# Altium project PROC154E3_SCH.PrjPcb (part 37 of 60)

## Sheet 42. DISPLAY PORT.SchDoc: DISPLAY_PORT_INTERFACE
size 513 x 386 mm; Project: PROC154E2(001)_SK_AM69; Issue: 1.0; RevCode: E3; Page Create Date: March  8, 1995; Variant Name: Core Design; Schematic Page Number: 42; Page Number: 42; Page Size: C; Comment: MISTRAL_TITLEBLK_CSIZE_1; Page Count: 62; Schematic Page Count: 62; Name: PROC154E2 001 SK AM69; DsnPath: C:\Users\danie\Downloads\sprr466c\PROC154E3_RP\PROC154E3_SCH.DSN; SchematicName: SCHEMATIC1; PageName: 42. DISPLAY PORT; PageSize: C; TopSchematic: True
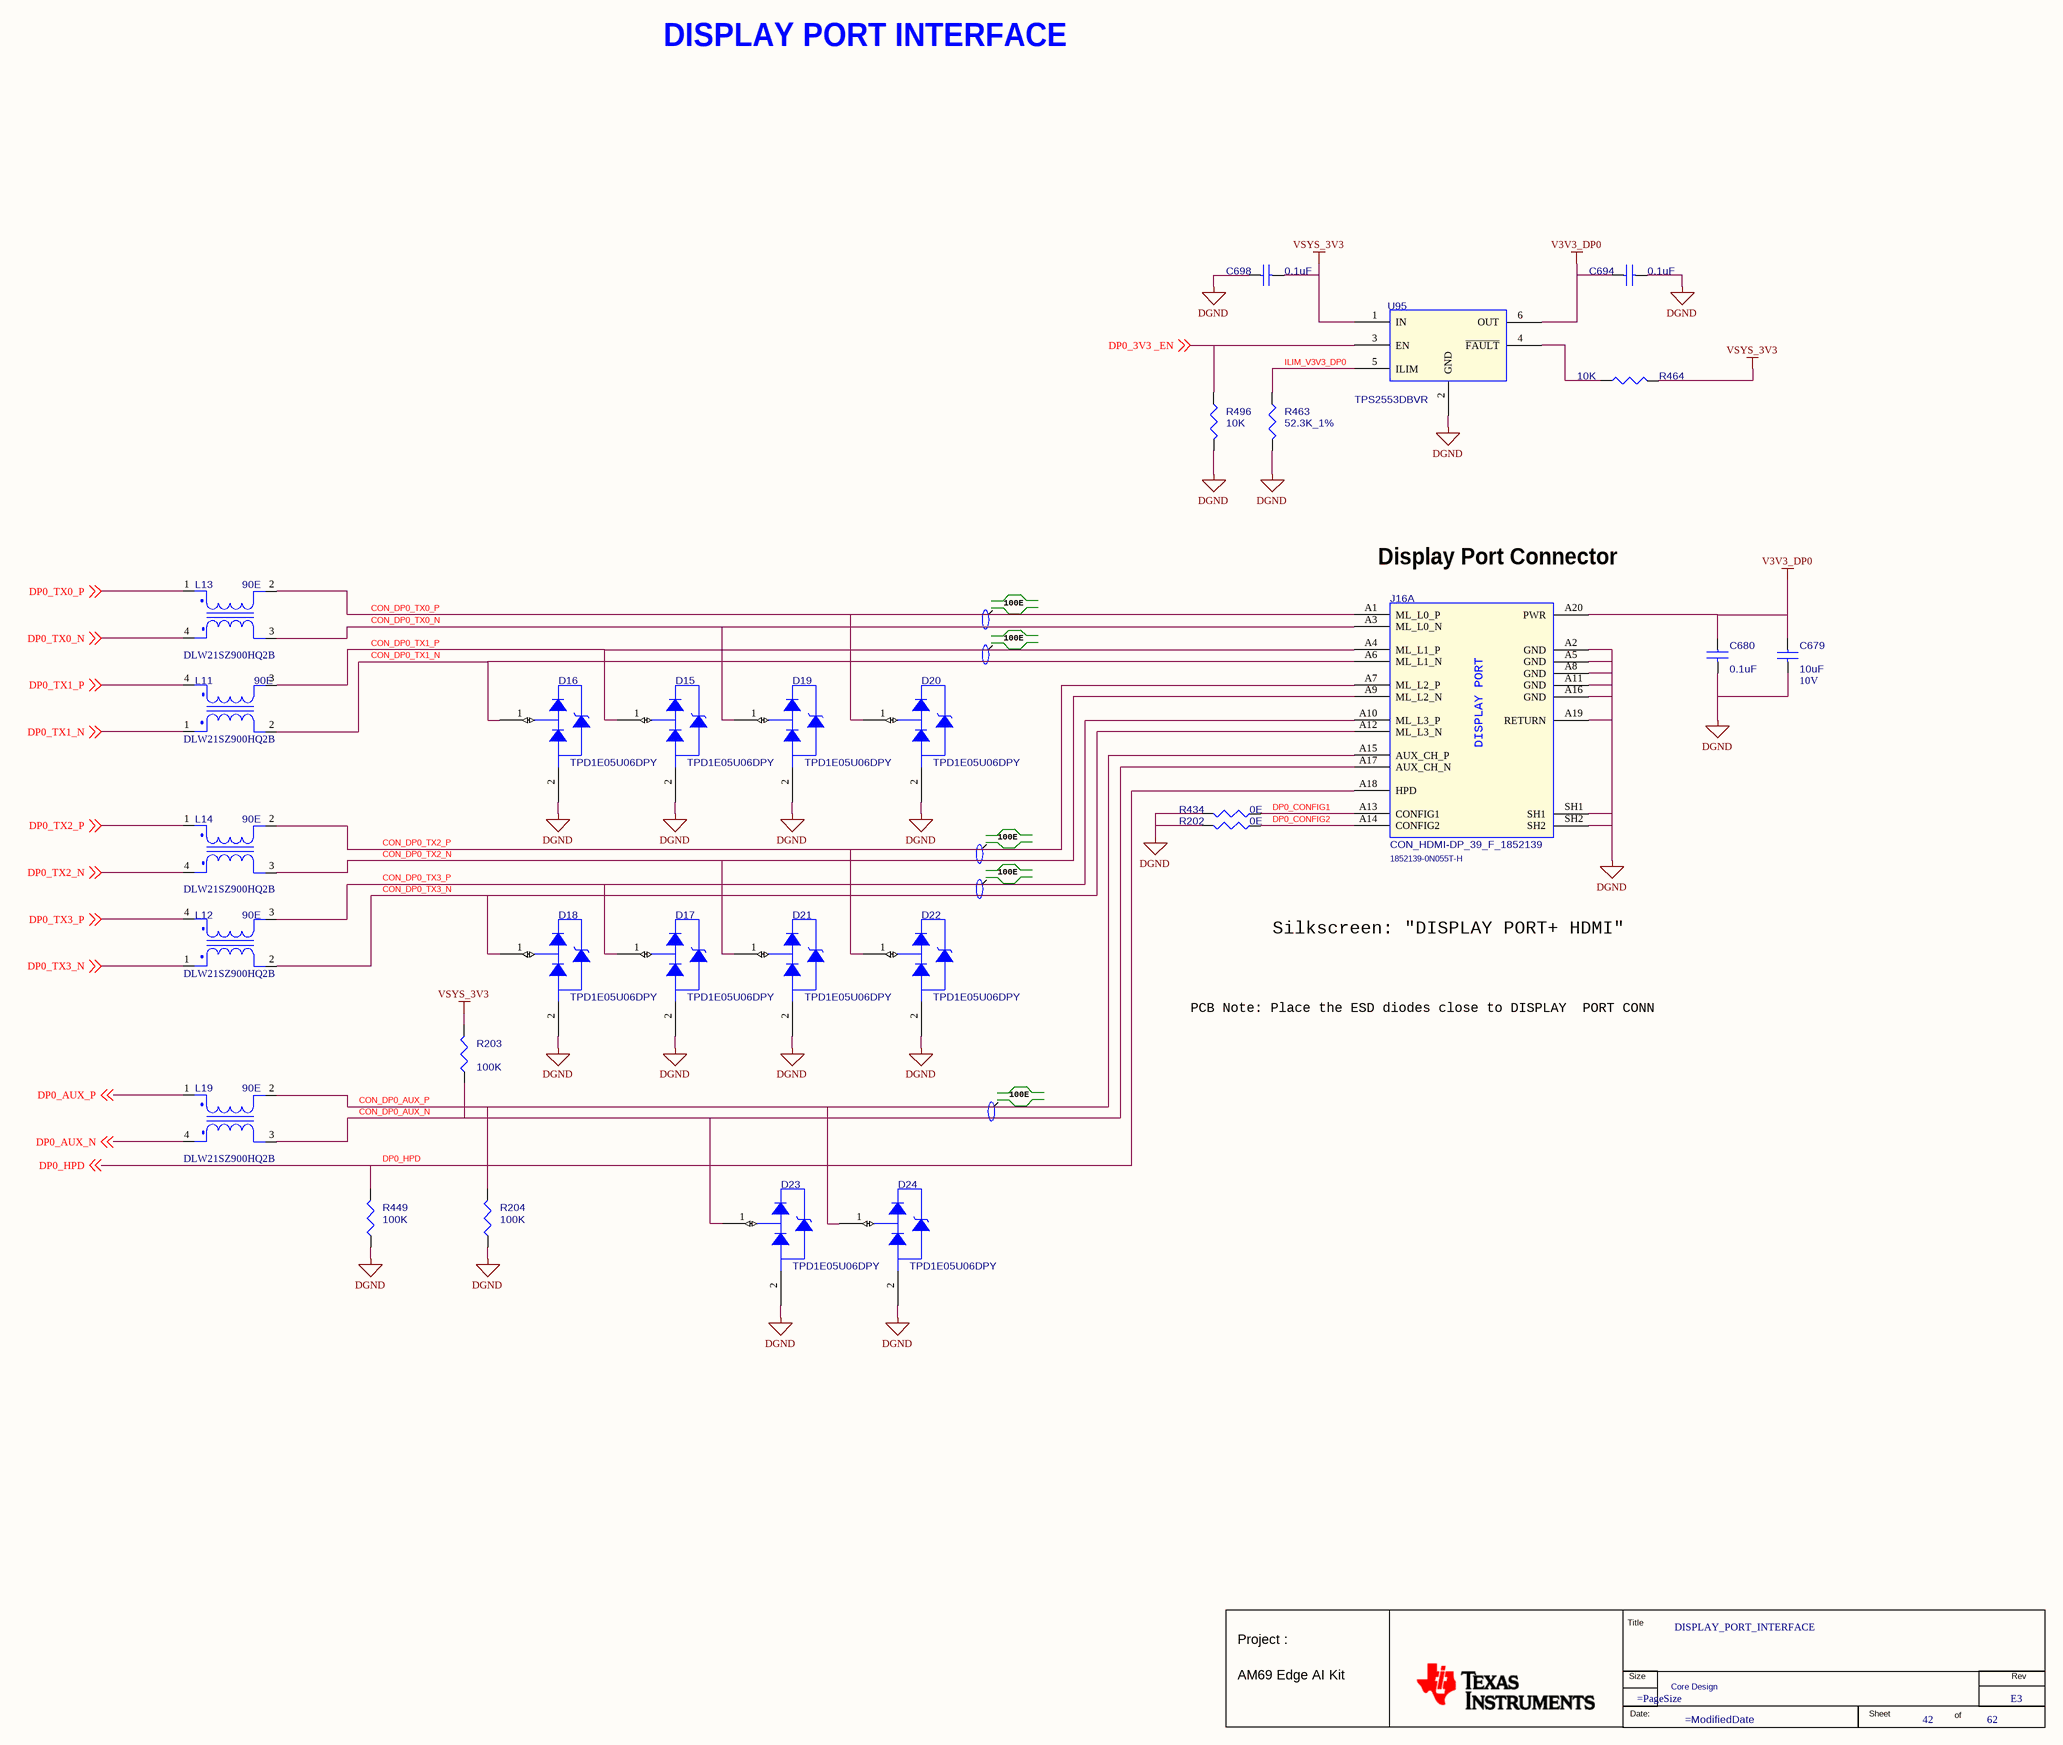
[diagram p69: 42. DISPLAY PORT.SchDoc]

### Parts
(Parts that share a designator on the sheet are numbered #1, #2 ... from top to bottom, then left to right.)
*#42  RevCode: E3  Title: DISPLAY_PORT_INTERFACE  Page Number: 42  Page Count: 62  Variant Name: Core Design  (hidden comment: MISTRAL_TITLEBLK_CSIZE_1)  (graphical)
C679  10uF  Voltage: 10V  [CAP0402_1]
C680  0.1uF  [CAP0201_0-5]
C694  0.1uF  [CAP0201_0-5]
C698  0.1uF  [CAP0201_0-5]
D15  TPD1E05U06DPY  [DIO_DFN0402_0-5]
D16  TPD1E05U06DPY  [DIO_DFN0402_0-5]
D17  TPD1E05U06DPY  [DIO_DFN0402_0-5]
D18  TPD1E05U06DPY  [DIO_DFN0402_0-5]
D19  TPD1E05U06DPY  [DIO_DFN0402_0-5]
D20  TPD1E05U06DPY  [DIO_DFN0402_0-5]
D21  TPD1E05U06DPY  [DIO_DFN0402_0-5]
D22  TPD1E05U06DPY  [DIO_DFN0402_0-5]
D23  TPD1E05U06DPY  [DIO_DFN0402_0-5]
D24  TPD1E05U06DPY  [DIO_DFN0402_0-5]
J16  CON_HDMI-DP_39_F_1852139  Mfr_part_number: 1852139-0N055T-H  [CON_HDMI-DP39_1852139-0N055_S_R_T_19-8]  (part A of 2)
L11  90E  Mfr_part_number: DLW21SZ900HQ2B  [IND4_DLW21H_90X60_SMD_1-4]
L12  90E  Mfr_part_number: DLW21SZ900HQ2B  [IND4_DLW21H_90X60_SMD_1-4]
L13  90E  Mfr_part_number: DLW21SZ900HQ2B  [IND4_DLW21H_90X60_SMD_1-4]
L14  90E  Mfr_part_number: DLW21SZ900HQ2B  [IND4_DLW21H_90X60_SMD_1-4]
L19  90E  Mfr_part_number: DLW21SZ900HQ2B  [IND4_DLW21H_90X60_SMD_1-4]
R202  0E  [RES0402_0-5]
R203  100K  [RES0402_0-5]
R204  100K  [RES0402_0-5]
R434  0E  [RES0402_0-5]
R449  100K  [RES0402_0-5]
R463  52.3K_1%  [RES0201_0-5]
R464  10K  [RES0201_0-5]
R496  10K  [RES0201_0-5]
U95  TPS2553DBVR  [SOT23-6_1-5]

### Nets
DGND: C679.2 C680.2 C694.2 C698.1 D15.2(GND) D16.2(GND) D17.2(GND) D18.2(GND) D19.2(GND) D20.2(GND) D21.2(GND) D22.2(GND) D23.2(GND) D24.2(GND) J16.A2(GND) J16.A5(GND) J16.A8(GND) J16.A11(GND) J16.A16(GND) J16.A19(RETURN) J16.SH1 J16.SH2 R202.2 R204.1 R434.2 R449.1 R463.2 R496.2 U95.2(GND)  [project net VDD_CPU_HCPS_GOSNS]
V3V3_DP0: C679.1 C680.1 C694.1 J16.A20(PWR) U95.6(OUT)
VSYS_3V3: C698.2 R203.2 R464.1 U95.1(IN)  [project net V_3V3]
CON_DP0_AUX_N: D23.1(I/O) J16.A17(AUX_CH_N) L19.3(OUT1) R203.1
CON_DP0_AUX_P: D24.1(I/O) J16.A15(AUX_CH_P) L19.2(IN2) R204.2
CON_DP0_TX0_N: D19.1(I/O) J16.A3(ML_L0_N) L13.3(OUT1)
CON_DP0_TX0_P: D20.1(I/O) J16.A1(ML_L0_P) L13.2(IN2)
CON_DP0_TX1_N: D16.1(I/O) J16.A6(ML_L1_N) L11.2(IN2)
CON_DP0_TX1_P: D15.1(I/O) J16.A4(ML_L1_P) L11.3(OUT1)
CON_DP0_TX2_N: D21.1(I/O) J16.A9(ML_L2_N) L14.3(OUT1)
CON_DP0_TX2_P: D22.1(I/O) J16.A7(ML_L2_P) L14.2(IN2)
CON_DP0_TX3_N: D18.1(I/O) J16.A12(ML_L3_N) L12.2(IN2)
CON_DP0_TX3_P: D17.1(I/O) J16.A10(ML_L3_P) L12.3(OUT1)
DP0_3V3 _EN: R496.1 U95.3(EN) ; off-sheet DP0_3V3 _EN
DP0_AUX_N: L19.4(OUT2) ; off-sheet DP0_AUX_N
DP0_AUX_P: L19.1(IN1) ; off-sheet DP0_AUX_P
DP0_CONFIG1: J16.A13(CONFIG1) R434.1
DP0_CONFIG2: J16.A14(CONFIG2) R202.1
DP0_HPD: J16.A18(HPD) R449.2 ; off-sheet DP0_HPD
DP0_TX0_N: L13.4(OUT2) ; off-sheet DP0_TX0_N
DP0_TX0_P: L13.1(IN1) ; off-sheet DP0_TX0_P
DP0_TX1_N: L11.1(IN1) ; off-sheet DP0_TX1_N
DP0_TX1_P: L11.4(OUT2) ; off-sheet DP0_TX1_P
DP0_TX2_N: L14.4(OUT2) ; off-sheet DP0_TX2_N
DP0_TX2_P: L14.1(IN1) ; off-sheet DP0_TX2_P
DP0_TX3_N: L12.1(IN1) ; off-sheet DP0_TX3_N
DP0_TX3_P: L12.4(OUT2) ; off-sheet DP0_TX3_P
ILIM_V3V3_DP0: R463.1 U95.5(ILIM)
NetR464_2: R464.2 U95.4(~{FAULT})

### Notes on the sheet
- DISPLAY PORT INTERFACE
- (near J16) Display Port Connector
- 100E
- Silkscreen: "DISPLAY PORT+ HDMI"
- PCB Note: Place the ESD diodes close to DISPLAY  PORT CONN
- (in symbol CON_HDMI-DP_39_F_1852139, part A) DISPLAY PORT
- (in symbol MISTRAL_TITLEBLK_CSIZE_1) Title; Project :; Size; Rev; AM69 Edge AI Kit; Date:; Sheet; of

### Library data of the parts
*#42 = MISTRAL_TITLEBLK_CSIZE_1: as *#41 on sheet 41. FPC Camera; Page Create Date: March  8, 1995; Page Size: =PageSize; Page Modify Date: =ModifiedDate; Schematic Page Count: 62; Schematic Page Number: 42
C679 = CAP_Dup1: CAP CERAMIC 10uF 10V 20% X5R 0402; Part Reference: C679; Part_type: CAPACITORS\CERAMIC; Mfr_part_number: CL05A106MP8NUB8; Mfr_name: SAMSUNG; Mistral Part No: 120019020008-R; Custom_Duty: 15%; Customs_HS_Code: 85322990; Project: TI_60GHz-AOP; Wattage: NA; Value: 10uF; PCB Footprint: CAP0402_1; Chkd/date: MANIRAJA/150219; Crtd /date: ALVY/150219; Datasheet: Y:\MIS_DATABASE\DATASHEETS\CAPACITORS\CL05A106MP8NUB8.PDF; Height: 0.90MM; Distributor_part_number: 1276-6830-1-ND; Distributor_name: DIGIKEY; Package: 0402; Tolerance: 20%; Library Ref: CAP; Footprint Ref: CAP0402_1; Weight: NA; Temperature: -55°C+85°C; MECHANICAL 3D STEP FILE: CAP0402_1; Library Path: Y:\MIS_DATABASE\Library\ALTIUM_TOOL\SCHEMATICS_PARTS\MS_DISCRETE_Library.schlib; Footprint Path: Y:\MIS_DATABASE\Library\ALTIUM_TOOL\PCB_FOOTPRINTS\Altium_Footprint_Lib.PcbLib
C680 = CAP_Dup1: CAP CERAMIC 0.1uF 16V 10% X7S AUTO 0201; Part Reference: C680; Mistral Part No: 120021030007-R; Mfr_name: MURATA; Mfr_part_number: GRT033C71C104KE01D; Part_type: CAPACITORS\CERAMIC; Project: J7ES_SK_BRD; Wattage: NA; Customs_HS_Code: 85322990; Custom_Duty: 15%; Value: 0.1uF; PCB Footprint: CAP0201_0-5; Tolerance: 10%; Voltage: 16V; Package: 0201; Distributor_name: DIGIKEY; Distributor_part_number: 490-GRT033C71C104KE01DTR-ND; Height: 0.33MM; Weight: 330mg; Temperature: -55°C+125°C; Datasheet: Y:\MIS_DATABASE\DATASHEETS\CAPACITORS\GRT033C71C104KE01.PDF; Crtd /date: ALVY/110321; Chkd/date: MANIRAJA/110321; MECHANICAL 3D STEP FILE: CAP0201_0-5
C694 = CAP_Dup1: CAP CERAMIC 0.1uF 16V 10% X7S AUTO 0201; Part Reference: C694; Part_type: CAPACITORS\CERAMIC; Mfr_part_number: GRT033C71C104KE01D; Mfr_name: MURATA; Mistral Part No: 120021030007-R; Custom_Duty: 15%; Customs_HS_Code: 85322990; Wattage: NA; Project: J7ES_SK_BRD; Value: 0.1uF; PCB Footprint: CAP0201_0-5; MECHANICAL 3D STEP FILE: CAP0201_0-5; Chkd/date: MANIRAJA/110321; Crtd /date: ALVY/110321; Datasheet: Y:\MIS_DATABASE\DATASHEETS\CAPACITORS\GRT033C71C104KE01.PDF; Temperature: -55°C+125°C; Weight: 330mg; Height: 0.33MM; Distributor_part_number: 490-GRT033C71C104KE01DTR-ND; Distributor_name: DIGIKEY; Package: 0201; Voltage: 16V; Tolerance: 10%
C698 = CAP_Dup1: CAP CERAMIC 0.1uF 16V 10% X7S AUTO 0201; Part Reference: C698; Mistral Part No: 120021030007-R; Mfr_name: MURATA; Mfr_part_number: GRT033C71C104KE01D; Part_type: CAPACITORS\CERAMIC; Project: J7ES_SK_BRD; Wattage: NA; Customs_HS_Code: 85322990; Custom_Duty: 15%; Value: 0.1uF; PCB Footprint: CAP0201_0-5; Tolerance: 10%; Voltage: 16V; Package: 0201; Distributor_name: DIGIKEY; Distributor_part_number: 490-GRT033C71C104KE01DTR-ND; Height: 0.33MM; Weight: 330mg; Temperature: -55°C+125°C; Datasheet: Y:\MIS_DATABASE\DATASHEETS\CAPACITORS\GRT033C71C104KE01.PDF; Crtd /date: ALVY/110321; Chkd/date: MANIRAJA/110321; MECHANICAL 3D STEP FILE: CAP0201_0-5
D15 = DIODE_TPD1E05U06: DIODE 1CH ESD PROTECTION FOR INTERFACE X1SON2; Part Reference: D15; Mistral Part No: 130018060037-R; Mfr_name: TEXAS INSTRUMENTS; Mfr_part_number: TPD1E05U06DPYT; Part_type: DIODE\TVS; Project: GOLDEN-I LITE; Tolerance: NA; Customs_HS_Code: 85412900; Custom_Duty: 15%; Value: TPD1E05U06DPY; PCB Footprint: DIO_DFN0402_0-5; Footprint Ref: DIO_DFN0402_0-5; Voltage: NA; Wattage: NA; Package: X1SON2; Distributor_name: DIGIKEY; Distributor_part_number: 296-39342-1-ND; Library Ref: DIODE_TPD1E05U06; Height: 0.45MM; Weight: 1mg; Temperature: -40°C+125°C; Datasheet: Y:\MIS_DATABASE\DATASHEETS\DISCRETES\DIODES\TPDXE05U06.PDF; Crtd /date: MANIRAJA/290618; Chkd/date: MANIRAJA/290618; MECHANICAL 3D STEP FILE: DIO_DFN0402_0-5; Library Path: Y:\MIS_DATABASE\Library\ALTIUM_TOOL\SCHEMATICS_PARTS\MS_DISCRETE_Library.schlib; Footprint Path: Y:\MIS_DATABASE\Library\ALTIUM_TOOL\PCB_FOOTPRINTS\Altium_Footprint_Lib.PcbLib
D16 = DIODE_TPD1E05U06: DIODE 1CH ESD PROTECTION FOR INTERFACE X1SON2; Part Reference: D16; Mistral Part No: 130018060037-R; Mfr_name: TEXAS INSTRUMENTS; Mfr_part_number: TPD1E05U06DPYT; Part_type: DIODE\TVS; Project: GOLDEN-I LITE; Tolerance: NA; Customs_HS_Code: 85412900; Custom_Duty: 15%; Value: TPD1E05U06DPY; PCB Footprint: DIO_DFN0402_0-5; Footprint Ref: DIO_DFN0402_0-5; Voltage: NA; Wattage: NA; Package: X1SON2; Distributor_name: DIGIKEY; Distributor_part_number: 296-39342-1-ND; Library Ref: DIODE_TPD1E05U06; Height: 0.45MM; Weight: 1mg; Temperature: -40°C+125°C; Datasheet: Y:\MIS_DATABASE\DATASHEETS\DISCRETES\DIODES\TPDXE05U06.PDF; Crtd /date: MANIRAJA/290618; Chkd/date: MANIRAJA/290618; MECHANICAL 3D STEP FILE: DIO_DFN0402_0-5; Library Path: Y:\MIS_DATABASE\Library\ALTIUM_TOOL\SCHEMATICS_PARTS\MS_DISCRETE_Library.schlib; Footprint Path: Y:\MIS_DATABASE\Library\ALTIUM_TOOL\PCB_FOOTPRINTS\Altium_Footprint_Lib.PcbLib
D17 = DIODE_TPD1E05U06: DIODE 1CH ESD PROTECTION FOR INTERFACE X1SON2; Part Reference: D17; Mistral Part No: 130018060037-R; Mfr_name: TEXAS INSTRUMENTS; Mfr_part_number: TPD1E05U06DPYT; Part_type: DIODE\TVS; Project: GOLDEN-I LITE; Tolerance: NA; Customs_HS_Code: 85412900; Custom_Duty: 15%; Value: TPD1E05U06DPY; PCB Footprint: DIO_DFN0402_0-5; Footprint Ref: DIO_DFN0402_0-5; Voltage: NA; Wattage: NA; Package: X1SON2; Distributor_name: DIGIKEY; Distributor_part_number: 296-39342-1-ND; Library Ref: DIODE_TPD1E05U06; Height: 0.45MM; Weight: 1mg; Temperature: -40°C+125°C; Datasheet: Y:\MIS_DATABASE\DATASHEETS\DISCRETES\DIODES\TPDXE05U06.PDF; Crtd /date: MANIRAJA/290618; Chkd/date: MANIRAJA/290618; MECHANICAL 3D STEP FILE: DIO_DFN0402_0-5; Library Path: Y:\MIS_DATABASE\Library\ALTIUM_TOOL\SCHEMATICS_PARTS\MS_DISCRETE_Library.schlib; Footprint Path: Y:\MIS_DATABASE\Library\ALTIUM_TOOL\PCB_FOOTPRINTS\Altium_Footprint_Lib.PcbLib
D18 = DIODE_TPD1E05U06: DIODE 1CH ESD PROTECTION FOR INTERFACE X1SON2; Part Reference: D18; Mistral Part No: 130018060037-R; Mfr_name: TEXAS INSTRUMENTS; Mfr_part_number: TPD1E05U06DPYT; Part_type: DIODE\TVS; Project: GOLDEN-I LITE; Tolerance: NA; Customs_HS_Code: 85412900; Custom_Duty: 15%; Value: TPD1E05U06DPY; PCB Footprint: DIO_DFN0402_0-5; Footprint Ref: DIO_DFN0402_0-5; Voltage: NA; Wattage: NA; Package: X1SON2; Distributor_name: DIGIKEY; Distributor_part_number: 296-39342-1-ND; Library Ref: DIODE_TPD1E05U06; Height: 0.45MM; Weight: 1mg; Temperature: -40°C+125°C; Datasheet: Y:\MIS_DATABASE\DATASHEETS\DISCRETES\DIODES\TPDXE05U06.PDF; Crtd /date: MANIRAJA/290618; Chkd/date: MANIRAJA/290618; MECHANICAL 3D STEP FILE: DIO_DFN0402_0-5; Library Path: Y:\MIS_DATABASE\Library\ALTIUM_TOOL\SCHEMATICS_PARTS\MS_DISCRETE_Library.schlib; Footprint Path: Y:\MIS_DATABASE\Library\ALTIUM_TOOL\PCB_FOOTPRINTS\Altium_Footprint_Lib.PcbLib
D19 = DIODE_TPD1E05U06: DIODE 1CH ESD PROTECTION FOR INTERFACE X1SON2; Part Reference: D19; Mistral Part No: 130018060037-R; Mfr_name: TEXAS INSTRUMENTS; Mfr_part_number: TPD1E05U06DPYT; Part_type: DIODE\TVS; Project: GOLDEN-I LITE; Tolerance: NA; Customs_HS_Code: 85412900; Custom_Duty: 15%; Value: TPD1E05U06DPY; PCB Footprint: DIO_DFN0402_0-5; Footprint Ref: DIO_DFN0402_0-5; Voltage: NA; Wattage: NA; Package: X1SON2; Distributor_name: DIGIKEY; Distributor_part_number: 296-39342-1-ND; Library Ref: DIODE_TPD1E05U06; Height: 0.45MM; Weight: 1mg; Temperature: -40°C+125°C; Datasheet: Y:\MIS_DATABASE\DATASHEETS\DISCRETES\DIODES\TPDXE05U06.PDF; Crtd /date: MANIRAJA/290618; Chkd/date: MANIRAJA/290618; MECHANICAL 3D STEP FILE: DIO_DFN0402_0-5; Library Path: Y:\MIS_DATABASE\Library\ALTIUM_TOOL\SCHEMATICS_PARTS\MS_DISCRETE_Library.schlib; Footprint Path: Y:\MIS_DATABASE\Library\ALTIUM_TOOL\PCB_FOOTPRINTS\Altium_Footprint_Lib.PcbLib
D20 = DIODE_TPD1E05U06: DIODE 1CH ESD PROTECTION FOR INTERFACE X1SON2; Part Reference: D20; Part_type: DIODE\TVS; Mfr_part_number: TPD1E05U06DPYT; Mfr_name: TEXAS INSTRUMENTS; Mistral Part No: 130018060037-R; Custom_Duty: 15%; Customs_HS_Code: 85412900; Wattage: NA; Project: GOLDEN-I LITE; Value: TPD1E05U06DPY; PCB Footprint: DIO_DFN0402_0-5; Footprint Path: Y:\MIS_DATABASE\Library\ALTIUM_TOOL\PCB_FOOTPRINTS\Altium_Footprint_Lib.PcbLib; Library Path: Y:\MIS_DATABASE\Library\ALTIUM_TOOL\SCHEMATICS_PARTS\MS_DISCRETE_Library.schlib; MECHANICAL 3D STEP FILE: DIO_DFN0402_0-5; Chkd/date: MANIRAJA/290618; Crtd /date: MANIRAJA/290618; Datasheet: Y:\MIS_DATABASE\DATASHEETS\DISCRETES\DIODES\TPDXE05U06.PDF; Temperature: -40°C+125°C; Weight: 1mg; Height: 0.45MM; Library Ref: DIODE_TPD1E05U06; Distributor_part_number: 296-39342-1-ND; Distributor_name: DIGIKEY; Package: X1SON2; Voltage: NA; Tolerance: NA; Footprint Ref: DIO_DFN0402_0-5
D21 = DIODE_TPD1E05U06: DIODE 1CH ESD PROTECTION FOR INTERFACE X1SON2; Part Reference: D21; Mistral Part No: 130018060037-R; Mfr_name: TEXAS INSTRUMENTS; Mfr_part_number: TPD1E05U06DPYT; Part_type: DIODE\TVS; Project: GOLDEN-I LITE; Tolerance: NA; Customs_HS_Code: 85412900; Custom_Duty: 15%; Value: TPD1E05U06DPY; PCB Footprint: DIO_DFN0402_0-5; Footprint Ref: DIO_DFN0402_0-5; Voltage: NA; Wattage: NA; Package: X1SON2; Distributor_name: DIGIKEY; Distributor_part_number: 296-39342-1-ND; Library Ref: DIODE_TPD1E05U06; Height: 0.45MM; Weight: 1mg; Temperature: -40°C+125°C; Datasheet: Y:\MIS_DATABASE\DATASHEETS\DISCRETES\DIODES\TPDXE05U06.PDF; Crtd /date: MANIRAJA/290618; Chkd/date: MANIRAJA/290618; MECHANICAL 3D STEP FILE: DIO_DFN0402_0-5; Library Path: Y:\MIS_DATABASE\Library\ALTIUM_TOOL\SCHEMATICS_PARTS\MS_DISCRETE_Library.schlib; Footprint Path: Y:\MIS_DATABASE\Library\ALTIUM_TOOL\PCB_FOOTPRINTS\Altium_Footprint_Lib.PcbLib
D22 = DIODE_TPD1E05U06: DIODE 1CH ESD PROTECTION FOR INTERFACE X1SON2; Part Reference: D22; Part_type: DIODE\TVS; Mfr_part_number: TPD1E05U06DPYT; Mfr_name: TEXAS INSTRUMENTS; Mistral Part No: 130018060037-R; Custom_Duty: 15%; Customs_HS_Code: 85412900; Wattage: NA; Project: GOLDEN-I LITE; Value: TPD1E05U06DPY; PCB Footprint: DIO_DFN0402_0-5; Footprint Path: Y:\MIS_DATABASE\Library\ALTIUM_TOOL\PCB_FOOTPRINTS\Altium_Footprint_Lib.PcbLib; Library Path: Y:\MIS_DATABASE\Library\ALTIUM_TOOL\SCHEMATICS_PARTS\MS_DISCRETE_Library.schlib; MECHANICAL 3D STEP FILE: DIO_DFN0402_0-5; Chkd/date: MANIRAJA/290618; Crtd /date: MANIRAJA/290618; Datasheet: Y:\MIS_DATABASE\DATASHEETS\DISCRETES\DIODES\TPDXE05U06.PDF; Temperature: -40°C+125°C; Weight: 1mg; Height: 0.45MM; Library Ref: DIODE_TPD1E05U06; Distributor_part_number: 296-39342-1-ND; Distributor_name: DIGIKEY; Package: X1SON2; Voltage: NA; Tolerance: NA; Footprint Ref: DIO_DFN0402_0-5
D23 = DIODE_TPD1E05U06: DIODE 1CH ESD PROTECTION FOR INTERFACE X1SON2; Part Reference: D23; Part_type: DIODE\TVS; Mfr_part_number: TPD1E05U06DPYT; Mfr_name: TEXAS INSTRUMENTS; Mistral Part No: 130018060037-R; Custom_Duty: 15%; Customs_HS_Code: 85412900; Wattage: NA; Project: GOLDEN-I LITE; Value: TPD1E05U06DPY; PCB Footprint: DIO_DFN0402_0-5; Footprint Path: Y:\MIS_DATABASE\Library\ALTIUM_TOOL\PCB_FOOTPRINTS\Altium_Footprint_Lib.PcbLib; Library Path: Y:\MIS_DATABASE\Library\ALTIUM_TOOL\SCHEMATICS_PARTS\MS_DISCRETE_Library.schlib; MECHANICAL 3D STEP FILE: DIO_DFN0402_0-5; Chkd/date: MANIRAJA/290618; Crtd /date: MANIRAJA/290618; Datasheet: Y:\MIS_DATABASE\DATASHEETS\DISCRETES\DIODES\TPDXE05U06.PDF; Temperature: -40°C+125°C; Weight: 1mg; Height: 0.45MM; Library Ref: DIODE_TPD1E05U06; Distributor_part_number: 296-39342-1-ND; Distributor_name: DIGIKEY; Package: X1SON2; Voltage: NA; Tolerance: NA; Footprint Ref: DIO_DFN0402_0-5
D24 = DIODE_TPD1E05U06: DIODE 1CH ESD PROTECTION FOR INTERFACE X1SON2; Part Reference: D24; Part_type: DIODE\TVS; Mfr_part_number: TPD1E05U06DPYT; Mfr_name: TEXAS INSTRUMENTS; Mistral Part No: 130018060037-R; Custom_Duty: 15%; Customs_HS_Code: 85412900; Wattage: NA; Project: GOLDEN-I LITE; Value: TPD1E05U06DPY; PCB Footprint: DIO_DFN0402_0-5; Footprint Path: Y:\MIS_DATABASE\Library\ALTIUM_TOOL\PCB_FOOTPRINTS\Altium_Footprint_Lib.PcbLib; Library Path: Y:\MIS_DATABASE\Library\ALTIUM_TOOL\SCHEMATICS_PARTS\MS_DISCRETE_Library.schlib; MECHANICAL 3D STEP FILE: DIO_DFN0402_0-5; Chkd/date: MANIRAJA/290618; Crtd /date: MANIRAJA/290618; Datasheet: Y:\MIS_DATABASE\DATASHEETS\DISCRETES\DIODES\TPDXE05U06.PDF; Temperature: -40°C+125°C; Weight: 1mg; Height: 0.45MM; Library Ref: DIODE_TPD1E05U06; Distributor_part_number: 296-39342-1-ND; Distributor_name: DIGIKEY; Package: X1SON2; Voltage: NA; Tolerance: NA; Footprint Ref: DIO_DFN0402_0-5
J16 = CON_HDMI-DP_39_F_1852139: CON HDMI AND DISPLAY PORT STACKED 39POS FEMALE RT TH; Part Reference: J16; Mistral Part No: 150021020056; Mfr_name: ASTRON; Part_type: CONNECTOR\JACK; Project: J7ES_SK_BRD; Tolerance: NA; Customs_HS_Code: 85369090; Custom_Duty: 24%; Value: CON_HDMI-DP_39_F_1852139; PCB Footprint: CON_HDMI-DP39_1852139-0N055_S_R_T_19-8; Footprint Ref: CON_HDMI-DP39_1852139-0N055_S_R_T_19-8; Voltage: NA; Wattage: NA; Package: THRU-HOLE; Distributor_name: NA; Distributor_part_number: NA; Library Ref: CON_HDMI-DP_39_F_1852139; Height: 19.80MM; Weight: NA; Temperature: -25°C+85°C; Datasheet: Y:\MIS_DATABASE\DATASHEETS\CONNECTORS\1852139-0N055T-H.PDF; Crtd /date: ALVY/180221; Chkd/date: MANIRAJA/190221; RoHS: NA; MECHANICAL 3D STEP FILE: CON_HDMI-DP39_1852139-0N055_S_R_T_19-8; Library Path: Y:\MIS_DATABASE\Library\ALTIUM_TOOL\SCHEMATICS_PARTS\MS_CONNECTOR_Library.schlib; Footprint Path: Y:\MIS_DATABASE\Library\ALTIUM_TOOL\PCB_FOOTPRINTS\Altium_Footprint_Lib.PcbLib
L11 = INDUCTOR_DLW31S: IND COMMON MODE CHOKE 90E 280mA SMD; Part Reference: L11; Mfr_name: MURATA; Mistral Part No: 130019060035-R; Custom_Duty: 24%; Customs_HS_Code: 85437099; Wattage: NA; Project: TI_J7ES_CP; SIGNAL_MODEL: INDUCTOR_DLW31S_IND4_DLW21H_90X_90E; Value: 90E; PCB Footprint: IND4_DLW21H_90X60_SMD_1-4; Footprint Path: Y:\MIS_DATABASE\Library\ALTIUM_TOOL\PCB_FOOTPRINTS\Altium_Footprint_Lib.PcbLib; Library Path: Y:\MIS_DATABASE\Library\ALTIUM_TOOL\SCHEMATICS_PARTS\MS_DISCRETE_Library.schlib; MECHANICAL 3D STEP FILE: IND4_DLW21H_90X60_SMD_1-4; Chkd/date: MANIRAJA/270619; Crtd /date: MANIRAJA/270619; Datasheet: Y:\MIS_DATABASE\DATASHEETS\DISCRETES\INDUCTORS\DLW21SZ900HQ2B.PDF; Temperature: -40°C+105°C; Weight: 11mg; Height: 1.40MM; Library Ref: INDUCTOR_DLW31S; Distributor_part_number: NA; Distributor_name: NA; Package: SMD; Voltage: NA; Tolerance: NA; Part_type: INDUCTOR; Footprint Ref: IND4_DLW21H_90X60_SMD_1-4
L12 = INDUCTOR_DLW31S: IND COMMON MODE CHOKE 90E 280mA SMD; Part Reference: L12; Mfr_name: MURATA; Mistral Part No: 130019060035-R; Custom_Duty: 24%; Customs_HS_Code: 85437099; Wattage: NA; Project: TI_J7ES_CP; SIGNAL_MODEL: INDUCTOR_DLW31S_IND4_DLW21H_90X_90E; Value: 90E; PCB Footprint: IND4_DLW21H_90X60_SMD_1-4; Footprint Path: Y:\MIS_DATABASE\Library\ALTIUM_TOOL\PCB_FOOTPRINTS\Altium_Footprint_Lib.PcbLib; Library Path: Y:\MIS_DATABASE\Library\ALTIUM_TOOL\SCHEMATICS_PARTS\MS_DISCRETE_Library.schlib; MECHANICAL 3D STEP FILE: IND4_DLW21H_90X60_SMD_1-4; Chkd/date: MANIRAJA/270619; Crtd /date: MANIRAJA/270619; Datasheet: Y:\MIS_DATABASE\DATASHEETS\DISCRETES\INDUCTORS\DLW21SZ900HQ2B.PDF; Temperature: -40°C+105°C; Weight: 11mg; Height: 1.40MM; Library Ref: INDUCTOR_DLW31S; Distributor_part_number: NA; Distributor_name: NA; Package: SMD; Voltage: NA; Tolerance: NA; Part_type: INDUCTOR; Footprint Ref: IND4_DLW21H_90X60_SMD_1-4
L13 = INDUCTOR_DLW31S: IND COMMON MODE CHOKE 90E 280mA SMD; Part Reference: L13; Mistral Part No: 130019060035-R; Mfr_name: MURATA; Project: TI_J7ES_CP; Tolerance: NA; Customs_HS_Code: 85437099; Custom_Duty: 24%; SIGNAL_MODEL: INDUCTOR_DLW31S_IND4_DLW21H_90X_90E; Value: 90E; PCB Footprint: IND4_DLW21H_90X60_SMD_1-4; Footprint Ref: IND4_DLW21H_90X60_SMD_1-4; Part_type: INDUCTOR; Voltage: NA; Wattage: NA; Package: SMD; Distributor_name: NA; Distributor_part_number: NA; Library Ref: INDUCTOR_DLW31S; Height: 1.40MM; Weight: 11mg; Temperature: -40°C+105°C; Datasheet: Y:\MIS_DATABASE\DATASHEETS\DISCRETES\INDUCTORS\DLW21SZ900HQ2B.PDF; Crtd /date: MANIRAJA/270619; Chkd/date: MANIRAJA/270619; MECHANICAL 3D STEP FILE: IND4_DLW21H_90X60_SMD_1-4; Library Path: Y:\MIS_DATABASE\Library\ALTIUM_TOOL\SCHEMATICS_PARTS\MS_DISCRETE_Library.schlib; Footprint Path: Y:\MIS_DATABASE\Library\ALTIUM_TOOL\PCB_FOOTPRINTS\Altium_Footprint_Lib.PcbLib
L14 = INDUCTOR_DLW31S: IND COMMON MODE CHOKE 90E 280mA SMD; Part Reference: L14; Mistral Part No: 130019060035-R; Mfr_name: MURATA; Project: TI_J7ES_CP; Tolerance: NA; Customs_HS_Code: 85437099; Custom_Duty: 24%; SIGNAL_MODEL: INDUCTOR_DLW31S_IND4_DLW21H_90X_90E; Value: 90E; PCB Footprint: IND4_DLW21H_90X60_SMD_1-4; Footprint Ref: IND4_DLW21H_90X60_SMD_1-4; Part_type: INDUCTOR; Voltage: NA; Wattage: NA; Package: SMD; Distributor_name: NA; Distributor_part_number: NA; Library Ref: INDUCTOR_DLW31S; Height: 1.40MM; Weight: 11mg; Temperature: -40°C+105°C; Datasheet: Y:\MIS_DATABASE\DATASHEETS\DISCRETES\INDUCTORS\DLW21SZ900HQ2B.PDF; Crtd /date: MANIRAJA/270619; Chkd/date: MANIRAJA/270619; MECHANICAL 3D STEP FILE: IND4_DLW21H_90X60_SMD_1-4; Library Path: Y:\MIS_DATABASE\Library\ALTIUM_TOOL\SCHEMATICS_PARTS\MS_DISCRETE_Library.schlib; Footprint Path: Y:\MIS_DATABASE\Library\ALTIUM_TOOL\PCB_FOOTPRINTS\Altium_Footprint_Lib.PcbLib
L19 = INDUCTOR_DLW31S: IND COMMON MODE CHOKE 90E 280mA SMD; Part Reference: L19; Mfr_name: MURATA; Mistral Part No: 130019060035-R; Custom_Duty: 24%; Customs_HS_Code: 85437099; Wattage: NA; Project: TI_J7ES_CP; SIGNAL_MODEL: INDUCTOR_DLW31S_IND4_DLW21H_90X_90E; Value: 90E; PCB Footprint: IND4_DLW21H_90X60_SMD_1-4; Footprint Path: Y:\MIS_DATABASE\Library\ALTIUM_TOOL\PCB_FOOTPRINTS\Altium_Footprint_Lib.PcbLib; Library Path: Y:\MIS_DATABASE\Library\ALTIUM_TOOL\SCHEMATICS_PARTS\MS_DISCRETE_Library.schlib; MECHANICAL 3D STEP FILE: IND4_DLW21H_90X60_SMD_1-4; Chkd/date: MANIRAJA/270619; Crtd /date: MANIRAJA/270619; Datasheet: Y:\MIS_DATABASE\DATASHEETS\DISCRETES\INDUCTORS\DLW21SZ900HQ2B.PDF; Temperature: -40°C+105°C; Weight: 11mg; Height: 1.40MM; Library Ref: INDUCTOR_DLW31S; Distributor_part_number: NA; Distributor_name: NA; Package: SMD; Voltage: NA; Tolerance: NA; Part_type: INDUCTOR; Footprint Ref: IND4_DLW21H_90X60_SMD_1-4
R202 = RESISTOR_Dup2: RES 0E 1/10W JUMPER 0402; Part Reference: R202; Part_type: RESISTORS\FIXED; Mfr_part_number: ERJ-2GE0R00X; Mfr_name: PANASONIC-ECG; Mistral Part No: 110018030052-R; Custom_Duty: 15%; Customs_HS_Code: 85332119; Voltage: NA; Project: AEGIS POM; Value: 0E; PCB Footprint: RES0402_0-5; Footprint Path: Y:\MIS_DATABASE\Library\ALTIUM_TOOL\PCB_FOOTPRINTS\Altium_Footprint_Lib.PcbLib; Library Path: Y:\MIS_DATABASE\Library\ALTIUM_TOOL\SCHEMATICS_PARTS\MS_DISCRETE_Library.schlib; Footprint Ref: RES0402_0-5; Library Ref: RESISTOR; Chkd/date: VASANTHA/061216; Crtd /date: NAVEED/201014; Datasheet: Y:\MIS_DATABASE\DATASHEETS\RESISTORS\PAN-ERJSER_NOV17.PDF; Temperature: -55°C+155°C; Weight: 0.8mg; Height: 0.40MM; Distributor_part_number: P0.0JCT-ND; Distributor_name: DIGIKEY; Package: 0402; Wattage: 1/10W; Tolerance: NA; MECHANICAL 3D STEP FILE: RES0402_0-5
R203 = RESISTOR_Dup2: RES 100K 1/10W 5% 0402; Part Reference: R203; Mistral Part No: 110009030177-R; Mfr_name: PANASONIC-ECG; Mfr_part_number: ERJ-2GEJ104X; Part_type: RESISTORS\FIXED; Project: RED EYE; Voltage: NA; Customs_HS_Code: 85332119; Custom_Duty: 15%; Value: 100K; PCB Footprint: RES0402_0-5; Tolerance: 5%; Wattage: 1/10W; Package: 0402; Distributor_name: DIGIKEY; Distributor_part_number: P100KJCT-ND; Height: 0.40MM; Weight: 0.8mg; Temperature: -55°C+155°C; Datasheet: Y:\MIS_DATABASE\DATASHEETS\RESISTORS\PAN-ERJSER_NOV17.PDF; Crtd /date: GEETHA/190406; Chkd/date: VASANTHA/291216; Library Ref: RESISTOR; Footprint Ref: RES0402_0-5; MECHANICAL 3D STEP FILE: RES0402_0-5; Library Path: Y:\MIS_DATABASE\Library\ALTIUM_TOOL\SCHEMATICS_PARTS\MS_DISCRETE_Library.schlib; Footprint Path: Y:\MIS_DATABASE\Library\ALTIUM_TOOL\PCB_FOOTPRINTS\Altium_Footprint_Lib.PcbLib
R204 = RESISTOR_Dup2: RES 100K 1/10W 5% 0402; Part Reference: R204; Part_type: RESISTORS\FIXED; Mfr_part_number: ERJ-2GEJ104X; Mfr_name: PANASONIC-ECG; Mistral Part No: 110009030177-R; Custom_Duty: 15%; Customs_HS_Code: 85332119; Voltage: NA; Project: RED EYE; Value: 100K; PCB Footprint: RES0402_0-5; Footprint Path: Y:\MIS_DATABASE\Library\ALTIUM_TOOL\PCB_FOOTPRINTS\Altium_Footprint_Lib.PcbLib; Library Path: Y:\MIS_DATABASE\Library\ALTIUM_TOOL\SCHEMATICS_PARTS\MS_DISCRETE_Library.schlib; MECHANICAL 3D STEP FILE: RES0402_0-5; Footprint Ref: RES0402_0-5; Library Ref: RESISTOR; Chkd/date: VASANTHA/291216; Crtd /date: GEETHA/190406; Datasheet: Y:\MIS_DATABASE\DATASHEETS\RESISTORS\PAN-ERJSER_NOV17.PDF; Temperature: -55°C+155°C; Weight: 0.8mg; Height: 0.40MM; Distributor_part_number: P100KJCT-ND; Distributor_name: DIGIKEY; Package: 0402; Wattage: 1/10W; Tolerance: 5%
R434 = RESISTOR_Dup2: RES 0E 1/10W JUMPER 0402; Part Reference: R434; Mistral Part No: 110018030052-R; Mfr_name: PANASONIC-ECG; Mfr_part_number: ERJ-2GE0R00X; Part_type: RESISTORS\FIXED; Project: AEGIS POM; Tolerance: NA; Customs_HS_Code: 85332119; Custom_Duty: 15%; Value: 0E; PCB Footprint: RES0402_0-5; MECHANICAL 3D STEP FILE: RES0402_0-5; Voltage: NA; Wattage: 1/10W; Package: 0402; Distributor_name: DIGIKEY; Distributor_part_number: P0.0JCT-ND; Height: 0.40MM; Weight: 0.8mg; Temperature: -55°C+155°C; Datasheet: Y:\MIS_DATABASE\DATASHEETS\RESISTORS\PAN-ERJSER_NOV17.PDF; Crtd /date: NAVEED/201014; Chkd/date: VASANTHA/061216; Library Ref: RESISTOR; Footprint Ref: RES0402_0-5; Library Path: Y:\MIS_DATABASE\Library\ALTIUM_TOOL\SCHEMATICS_PARTS\MS_DISCRETE_Library.schlib; Footprint Path: Y:\MIS_DATABASE\Library\ALTIUM_TOOL\PCB_FOOTPRINTS\Altium_Footprint_Lib.PcbLib
R449 = RESISTOR_Dup2: RES 100K 1/10W 5% 0402; Part Reference: R449; Part_type: RESISTORS\FIXED; Mfr_part_number: ERJ-2GEJ104X; Mfr_name: PANASONIC-ECG; Mistral Part No: 110009030177-R; Custom_Duty: 15%; Customs_HS_Code: 85332119; Voltage: NA; Project: RED EYE; Value: 100K; PCB Footprint: RES0402_0-5; Footprint Path: Y:\MIS_DATABASE\Library\ALTIUM_TOOL\PCB_FOOTPRINTS\Altium_Footprint_Lib.PcbLib; Library Path: Y:\MIS_DATABASE\Library\ALTIUM_TOOL\SCHEMATICS_PARTS\MS_DISCRETE_Library.schlib; MECHANICAL 3D STEP FILE: RES0402_0-5; Footprint Ref: RES0402_0-5; Library Ref: RESISTOR; Chkd/date: VASANTHA/291216; Crtd /date: GEETHA/190406; Datasheet: Y:\MIS_DATABASE\DATASHEETS\RESISTORS\PAN-ERJSER_NOV17.PDF; Temperature: -55°C+155°C; Weight: 0.8mg; Height: 0.40MM; Distributor_part_number: P100KJCT-ND; Distributor_name: DIGIKEY; Package: 0402; Wattage: 1/10W; Tolerance: 5%
R463 = RESISTOR_Dup2: RES 52.3K 1/20W 1% 0201; Part Reference: R463; Mistral Part No: 110009030972-R; Mfr_name: PANASONIC-ECG; Mfr_part_number: ERJ-1GNF5232C; Part_type: RESISTORS\FIXED; Project: GOLDEN-I LITE; Voltage: NA; Customs_HS_Code: 85332119; Custom_Duty: 15%; Value: 52.3K_1%; PCB Footprint: RES0201_0-5; Footprint Ref: RES0201_0-5; Tolerance: 1%; Wattage: 1/20W; Package: 0201; Distributor_name: DIGIKEY; Distributor_part_number: ERJ-1GNF5232C-ND; Library Ref: RESISTOR; Height: 0.26MM; Weight: 0.15mg; Temperature: -55°C+125°C; Datasheet: Y:\MIS_DATABASE\DATASHEETS\RESISTORS\PAN-ERJSER_NOV17.PDF; Crtd /date: MANIRAJA/270117; Chkd/date: VASANTHA/270117; MECHANICAL 3D STEP FILE: RES0201_0-5; Library Path: Y:\MIS_DATABASE\Library\ALTIUM_TOOL\SCHEMATICS_PARTS\MS_DISCRETE_Library.schlib; Footprint Path: Y:\MIS_DATABASE\Library\ALTIUM_TOOL\PCB_FOOTPRINTS\Altium_Footprint_Lib.PcbLib
R464 = RESISTOR_Dup2: RES 10K 1/20W 5% 0201; Part Reference: R464; Part_type: RESISTORS\FIXED; Mfr_part_number: RC0201JR-0710KL; Mfr_name: YAGEO AMERICA; Mistral Part No: 110010070051-R; Custom_Duty: 15%; Customs_HS_Code: 85332119; Voltage: NA; Project: GOLDEN-I LITE; Value: 10K; PCB Footprint: RES0201_0-5; MECHANICAL 3D STEP FILE: RES0201_0-5; Chkd/date: MANIRAJA/050517; Crtd /date: MANIRAJA/050517; Datasheet: Y:\MIS_DATABASE\DATASHEETS\RESISTORS\RCXXXXL-SER_MAR18.PDF; Temperature: -55°C+125°C; Weight: 0.17mg; Height: 0.26MM; Distributor_part_number: 311-10KNCT-ND; Distributor_name: DIGIKEY; Package: 0201; Wattage: 1/20W; Tolerance: 5%; Library Ref: RESISTOR; Footprint Ref: RES0201_0-5; Library Path: Y:\MIS_DATABASE\Library\ALTIUM_TOOL\SCHEMATICS_PARTS\MS_DISCRETE_Library.schlib; Footprint Path: Y:\MIS_DATABASE\Library\ALTIUM_TOOL\PCB_FOOTPRINTS\Altium_Footprint_Lib.PcbLib
R496 = RESISTOR_Dup2: RES 10K 1/20W 5% 0201; Part Reference: R496; Mistral Part No: 110010070051-R; Mfr_name: YAGEO AMERICA; Mfr_part_number: RC0201JR-0710KL; Part_type: RESISTORS\FIXED; Project: GOLDEN-I LITE; Voltage: NA; Customs_HS_Code: 85332119; Custom_Duty: 15%; Value: 10K; PCB Footprint: RES0201_0-5; Footprint Ref: RES0201_0-5; Tolerance: 5%; Wattage: 1/20W; Package: 0201; Distributor_name: DIGIKEY; Distributor_part_number: 311-10KNCT-ND; Library Ref: RESISTOR; Height: 0.26MM; Weight: 0.17mg; Temperature: -55°C+125°C; Datasheet: Y:\MIS_DATABASE\DATASHEETS\RESISTORS\RCXXXXL-SER_MAR18.PDF; Crtd /date: MANIRAJA/050517; Chkd/date: MANIRAJA/050517; MECHANICAL 3D STEP FILE: RES0201_0-5; Library Path: Y:\MIS_DATABASE\Library\ALTIUM_TOOL\SCHEMATICS_PARTS\MS_DISCRETE_Library.schlib; Footprint Path: Y:\MIS_DATABASE\Library\ALTIUM_TOOL\PCB_FOOTPRINTS\Altium_Footprint_Lib.PcbLib
U95 = TPS2553DBVR_SOT23-6: IC ADJ CURRENT-LIMITED POWER DISTRIBUTION SWITCHES SOT23-6; Part Reference: U95; Mistral Part No: 142018020023-R; Mfr_name: TEXAS INSTRUMENTS; Part_type: ICS\POWER; Project: GRACO SMART MODULE; Tolerance: NA; Customs_HS_Code: 85423100; Custom_Duty: 15%; Value: TPS2553DBVR; PCB Footprint: SOT23-6_1-5; Footprint Ref: SOT23-6_1-5; Mfr_part_number: TPS2553DBVR; Voltage: NA; Wattage: NA; Package: SOT23-6; Distributor_name: DIGIKEY; Distributor_part_number: 296-32464-1-ND; Library Ref: TPS2553DBVR_SOT23-6; Height: 1.45MM; Weight: 36mg; Temperature: -40°C+85°C; Datasheet: Y:\MIS_DATABASE\DATASHEETS\ICS\POWER\TPS2553XX.PDF; Crtd /date: ALVY/190218; Chkd/date: MANIRAJA/190218; MECHANICAL 3D STEP FILE: SOT23-6_1-5; Library Path: Y:\MIS_DATABASE\Library\ALTIUM_TOOL\SCHEMATICS_PARTS\MS_MISCPOWER_Library.schlib; Footprint Path: Y:\MIS_DATABASE\Library\ALTIUM_TOOL\PCB_FOOTPRINTS\Altium_Footprint_Lib.PcbLib

## Sheet 43. HDMI BRIDGE.SchDoc: HDMI BRIDGE
size 513 x 386 mm; Project: PROC154E2(001)_SK_AM69; Issue: 1.0; RevCode: E3; Page Create Date: March  8, 1995; Variant Name: Core Design; Schematic Page Number: 43; Page Number: 43; Page Size: C; Comment: MISTRAL_TITLEBLK_CSIZE_1; Page Count: 62; Schematic Page Count: 62; Name: PROC154E2 001 SK AM69; DsnPath: C:\Users\danie\Downloads\sprr466c\PROC154E3_RP\PROC154E3_SCH.DSN; SchematicName: SCHEMATIC1; PageName: 43. HDMI BRIDGE; PageSize: C; TopSchematic: True
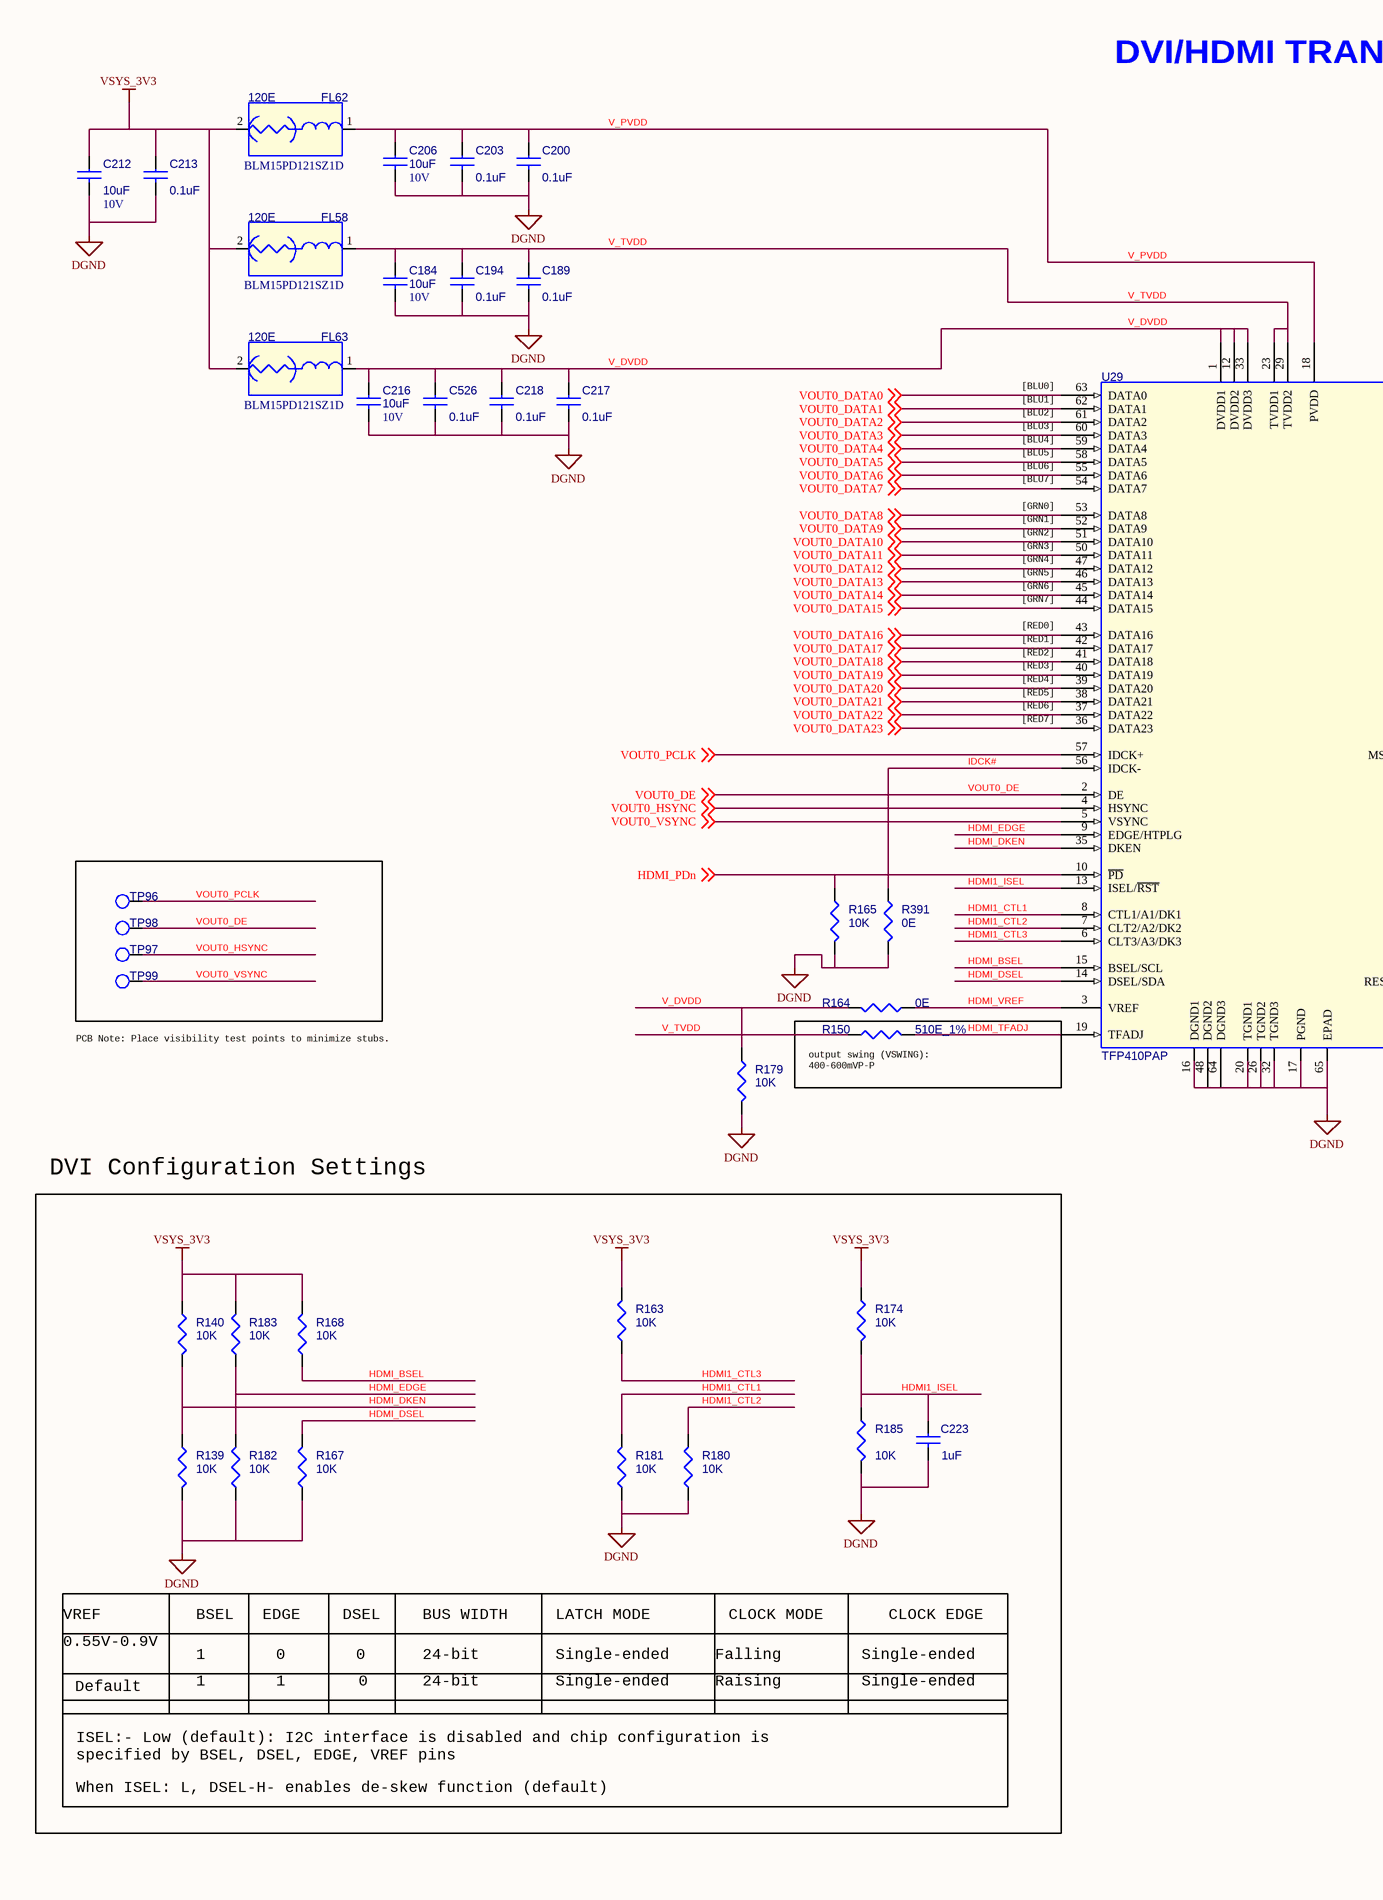
[diagram p70: 43. HDMI BRIDGE.SchDoc, left]
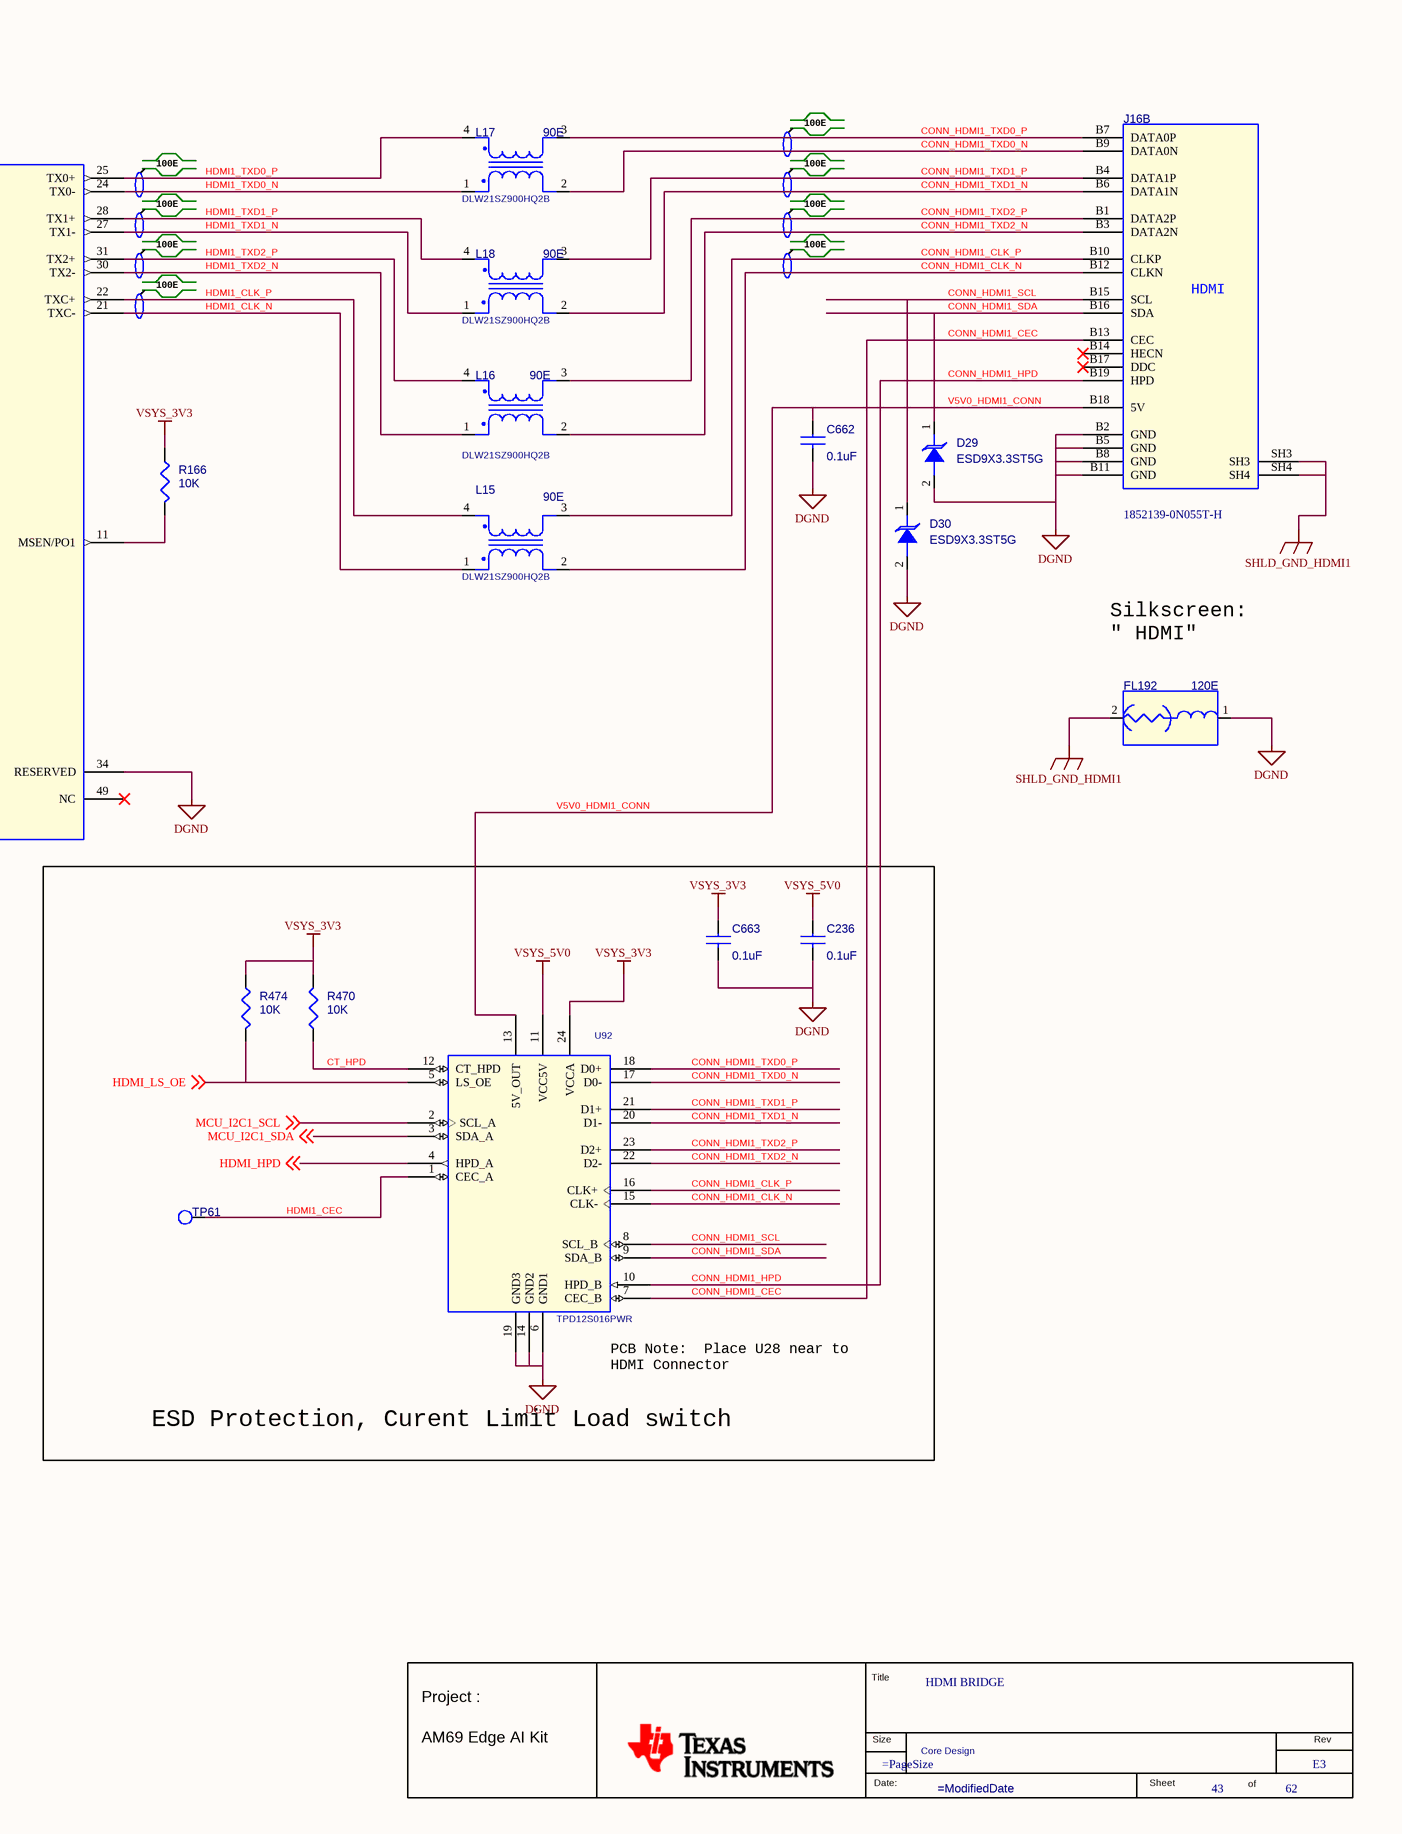
[diagram p71: 43. HDMI BRIDGE.SchDoc, right]

### Parts
(Parts that share a designator on the sheet are numbered #1, #2 ... from top to bottom, then left to right.)
*#43  RevCode: E3  Title: HDMI BRIDGE  Page Number: 43  Page Count: 62  Variant Name: Core Design  (hidden comment: MISTRAL_TITLEBLK_CSIZE_1)  (graphical)
C184  10uF  Voltage: 10V  [CAP0402_1]
C189  0.1uF  [CAP0201_0-5]
C194  0.1uF  [CAP0201_0-5]
C200  0.1uF  [CAP0201_0-5]
C203  0.1uF  [CAP0201_0-5]
C206  10uF  Voltage: 10V  [CAP0402_1]
C212  10uF  Voltage: 10V  [CAP0402_1]
C213  0.1uF  [CAP0201_0-5]
C216  10uF  Voltage: 10V  [CAP0402_1]
C217  0.1uF  [CAP0201_0-5]
C218  0.1uF  [CAP0201_0-5]
C223  1uF  [CAP0201_0-5]
C236  0.1uF  [CAP0201_0-5]
C526  0.1uF  [CAP0201_0-5]
C662  0.1uF  [CAP0201_0-5]
C663  0.1uF  [CAP0201_0-5]
D29  ESD9X3.3ST5G  [DIO_SOD923_0-5]
D30  ESD9X3.3ST5G  [DIO_SOD923_0-5]
FL58  120E  Mfr_part_number: BLM15PD121SZ1D  [EMIFIL_BLM15A_0402_0-6]
FL62  120E  Mfr_part_number: BLM15PD121SZ1D  [EMIFIL_BLM15A_0402_0-6]
FL63  120E  Mfr_part_number: BLM15PD121SZ1D  [EMIFIL_BLM15A_0402_0-6]
FL192  120E  [EMIFIL_BLM15A_0402_0-6]
J16  Mfr_part_number: 1852139-0N055T-H  [CON_HDMI-DP39_1852139-0N055_S_R_T_19-8]  (hidden comment: CON_HDMI-DP_39_F_1852139)  (part B of 2)
L15  90E  Mfr_part_number: DLW21SZ900HQ2B  [IND4_DLW21H_90X60_SMD_1-4]
L16  90E  Mfr_part_number: DLW21SZ900HQ2B  [IND4_DLW21H_90X60_SMD_1-4]
L17  90E  Mfr_part_number: DLW21SZ900HQ2B  [IND4_DLW21H_90X60_SMD_1-4]
L18  90E  Mfr_part_number: DLW21SZ900HQ2B  [IND4_DLW21H_90X60_SMD_1-4]
R139  10K  [RES0201_0-5]
R140  10K  [RES0201_0-5]
R150  510E_1%  [RES0402_0-5]
R163  10K  [RES0201_0-5]
R164  0E  [RES0402_0-5]
R165  10K  [RES0201_0-5]
R166  10K  [RES0402_0-5]
R167  10K  [RES0201_0-5]
R168  10K  [RES0201_0-5]
R174  10K  [RES0201_0-5]
R179  10K  [RES0201_0-5]
R180  10K  [RES0201_0-5]
R181  10K  [RES0201_0-5]
R182  10K  [RES0201_0-5]
R183  10K  [RES0201_0-5]
R185  10K  [RES0201_0-5]
R391  0E  [RES0402_0-5]
R470  10K  [RES0201_0-5]
R474  10K  [RES0201_0-5]
TP61  TP30_SMD  [TP30_SMD]  (value not drawn)
TP96  TP20_SMD  [TP20_SMD]  (value not drawn)
TP97  TP20_SMD  [TP20_SMD]  (value not drawn)
TP98  TP20_SMD  [TP20_SMD]  (value not drawn)
TP99  TP20_SMD  [TP20_SMD]  (value not drawn)
U29  TFP410PAP  [HTQFP64_19-68_400X400_1-2]
U92  TPD12S016PWR  [TSSOP24_25-59_315X180_1-2]

### Blocks framed on the sheet
ESD Protection, Curent Limit Load switch: C236 C663 R470 R474 TP61 U92
DVI Configuration Settings: C223 R139 R140 R163 R167 R168 R174 R180-R183 R185

### Nets
DGND: C184.2 C189.2 C194.2 C200.2 C203.2 C206.2 C212.2 C213.2 C216.2 C217.2 C218.2 C223.2 C236.2 C526.2 C662.2 C663.2 D29.2(ANODE) D30.2(ANODE) FL192.1 J16.B2(GND) J16.B5(GND) J16.B8(GND) J16.B11(GND) R139.2 R165.1 R167.2 R179.2 R180.2 R181.2 R182.2 R185.2 R391.2 U29.16(DGND1) U29.17(PGND) U29.20(TGND1) U29.26(TGND2) U29.32(TGND3) U29.34(RESERVED) U29.48(DGND2) U29.64(DGND3) U29.65(EPAD) U92.6(GND1) U92.14(GND2) U92.19(GND3)  [project net VDD_CPU_HCPS_GOSNS]
SHLD_GND_HDMI1: FL192.2 J16.SH3 J16.SH4
VSYS_3V3: C212.1 C213.1 C663.1 FL58.2 FL62.2 FL63.2 R140.1 R163.1 R166.2 R168.1 R174.1 R183.1 R470.2 R474.1 U92.24(VCCA)  [project net V_3V3]
VSYS_5V0: C236.1 U92.11(VCC5V)
CONN_HDMI1_CEC: J16.B13(CEC) U92.7(CEC_B)
CONN_HDMI1_CLK_N: J16.B12(CLKN) L15.2(IN2) U92.15(CLK-)
CONN_HDMI1_CLK_P: J16.B10(CLKP) L15.3(OUT1) U92.16(CLK+)
CONN_HDMI1_HPD: J16.B19(HPD) U92.10(HPD_B)
CONN_HDMI1_SCL: D30.1(CATHODE) J16.B15(SCL) U92.8(SCL_B)
CONN_HDMI1_SDA: D29.1(CATHODE) J16.B16(SDA) U92.9(SDA_B)
CONN_HDMI1_TXD0_N: J16.B9(DATA0N) L17.2(IN2) U92.17(D0-)
CONN_HDMI1_TXD0_P: J16.B7(DATA0P) L17.3(OUT1) U92.18(D0+)
CONN_HDMI1_TXD1_N: J16.B6(DATA1N) L18.2(IN2) U92.20(D1-)
CONN_HDMI1_TXD1_P: J16.B4(DATA1P) L18.3(OUT1) U92.21(D1+)
CONN_HDMI1_TXD2_N: J16.B3(DATA2N) L16.2(IN2) U92.22(D2-)
CONN_HDMI1_TXD2_P: J16.B1(DATA2P) L16.3(OUT1) U92.23(D2+)
CT_HPD: R470.1 U92.12(CT_HPD)
HDMI1_CEC: TP61.1(TP) U92.1(CEC_A)
HDMI1_CLK_N: L15.1(IN1) U29.21(TXC-)
HDMI1_CLK_P: L15.4(OUT2) U29.22(TXC+)
HDMI1_CTL1: R181.1 U29.8(CTL1/A1/DK1)
HDMI1_CTL2: R180.1 U29.7(CLT2/A2/DK2)
HDMI1_CTL3: R163.2 U29.6(CLT3/A3/DK3)
HDMI1_ISEL: C223.1 R174.2 R185.1 U29.13(ISEL/~{RST})
HDMI1_TXD0_N: L17.1(IN1) U29.24(TX0-)
HDMI1_TXD0_P: L17.4(OUT2) U29.25(TX0+)
HDMI1_TXD1_N: L18.1(IN1) U29.27(TX1-)
HDMI1_TXD1_P: L18.4(OUT2) U29.28(TX1+)
HDMI1_TXD2_N: L16.1(IN1) U29.30(TX2-)
HDMI1_TXD2_P: L16.4(OUT2) U29.31(TX2+)
HDMI_BSEL: R168.2 U29.15(BSEL/SCL)
HDMI_DKEN: R139.1 R140.2 U29.35(DKEN)
HDMI_DSEL: R167.1 U29.14(DSEL/SDA)
HDMI_EDGE: R182.1 R183.2 U29.9(EDGE/HTPLG)
HDMI_HPD: U92.4(HPD_A) ; off-sheet HDMI_HPD
HDMI_LS_OE: R474.2 U92.5(LS_OE) ; off-sheet HDMI_LS_OE
HDMI_PDn: R165.2 U29.10(~{PD}) ; off-sheet HDMI_PDn
HDMI_TFADJ: R150.2 U29.19(TFADJ)
HDMI_VREF: R164.1 U29.3(VREF)
IDCK#: R391.1 U29.56(IDCK-)
MCU_I2C1_SCL: U92.2(SCL_A) ; off-sheet MCU_I2C1_SCL
MCU_I2C1_SDA: U92.3(SDA_A) ; off-sheet MCU_I2C1_SDA
V5V0_HDMI1_CONN: C662.1 J16.B18(5V) U92.13(5V_OUT)
V_DVDD: C216.1 C217.1 C218.1 C526.1 FL63.1 R164.2 R179.1 U29.1(DVDD1) U29.12(DVDD2) U29.33(DVDD3)
V_PVDD: C200.1 C203.1 C206.1 FL62.1 U29.18(PVDD)
V_TVDD: C184.1 C189.1 C194.1 FL58.1 R150.1 U29.23(TVDD1) U29.29(TVDD2)
VOUT0_DATA0: U29.63(DATA0) ; off-sheet VOUT0_DATA0
VOUT0_DATA1: U29.62(DATA1) ; off-sheet VOUT0_DATA1
VOUT0_DATA2: U29.61(DATA2) ; off-sheet VOUT0_DATA2
VOUT0_DATA3: U29.60(DATA3) ; off-sheet VOUT0_DATA3
VOUT0_DATA4: U29.59(DATA4) ; off-sheet VOUT0_DATA4
VOUT0_DATA5: U29.58(DATA5) ; off-sheet VOUT0_DATA5
VOUT0_DATA6: U29.55(DATA6) ; off-sheet VOUT0_DATA6
VOUT0_DATA7: U29.54(DATA7) ; off-sheet VOUT0_DATA7
VOUT0_DATA8: U29.53(DATA8) ; off-sheet VOUT0_DATA8
VOUT0_DATA9: U29.52(DATA9) ; off-sheet VOUT0_DATA9
VOUT0_DATA10: U29.51(DATA10) ; off-sheet VOUT0_DATA10
VOUT0_DATA11: U29.50(DATA11) ; off-sheet VOUT0_DATA11
VOUT0_DATA12: U29.47(DATA12) ; off-sheet VOUT0_DATA12
VOUT0_DATA13: U29.46(DATA13) ; off-sheet VOUT0_DATA13
VOUT0_DATA14: U29.45(DATA14) ; off-sheet VOUT0_DATA14
VOUT0_DATA15: U29.44(DATA15) ; off-sheet VOUT0_DATA15
VOUT0_DATA16: U29.43(DATA16) ; off-sheet VOUT0_DATA16
VOUT0_DATA17: U29.42(DATA17) ; off-sheet VOUT0_DATA17
VOUT0_DATA18: U29.41(DATA18) ; off-sheet VOUT0_DATA18
VOUT0_DATA19: U29.40(DATA19) ; off-sheet VOUT0_DATA19
VOUT0_DATA20: U29.39(DATA20) ; off-sheet VOUT0_DATA20
VOUT0_DATA21: U29.38(DATA21) ; off-sheet VOUT0_DATA21
VOUT0_DATA22: U29.37(DATA22) ; off-sheet VOUT0_DATA22
VOUT0_DATA23: U29.36(DATA23) ; off-sheet VOUT0_DATA23
VOUT0_DE: TP98.1(TP) U29.2(DE) ; off-sheet VOUT0_DE
VOUT0_HSYNC: TP97.1(TP) U29.4(HSYNC) ; off-sheet VOUT0_HSYNC
VOUT0_PCLK: TP96.1(TP) U29.57(IDCK+) ; off-sheet VOUT0_PCLK
VOUT0_VSYNC: TP99.1(TP) U29.5(VSYNC) ; off-sheet VOUT0_VSYNC
NetR166_1: R166.1 U29.11(MSEN/PO1)

Not connected (* = marked no-connect by the designer): J16 B14(HECN)* B17(DDC)*; U29 49(NC)*

### Notes on the sheet
- DVI/HDMI TRANSMITTER
- 100E
- (near U29) [BLU0]
- (near U29) [BLU1]
- (near U29) [BLU2]
- (near U29) [BLU3]
- (near U29) [BLU4]
- (near U29) [BLU5]
- (near U29) [BLU6]
- (near U29) [BLU7]
- (near U29) [GRN0]
- (near U29) [GRN1]
- (near U29) [GRN2]
- (near U29) [GRN3]
- (near U29) [GRN4]
- (near U29) [GRN5]
- (near U29) [GRN6]
- (near U29) [GRN7]
- (near U29) [RED0]
- (near U29) [RED1]
- (near U29) [RED2]
- (near U29) [RED3]
- (near U29) [RED4]
- (near U29) [RED5]
- (near U29) [RED6]
- (near U29) [RED7]
- Silkscreen:
  " HDMI"
- PCB Note: Place visibility test points to minimize stubs.
- (near R150) output swing (VSWING):
  400-600mVP-P
- (near U92) PCB Note:  Place U28 near to
  HDMI Connector
- VREF
- BSEL
- EDGE
- DSEL
- BUS WIDTH
- LATCH MODE
- CLOCK MODE
- CLOCK EDGE
- 0.55V-0.9V
- Default
- 1
- 0
- 24-bit
- Single-ended
- Raising
- Falling
- ISEL:- Low (default): I2C interface is disabled and chip configuration is
  specified by BSEL, DSEL, EDGE, VREF pins
- When ISEL: L, DSEL-H- enables de-skew function (default)
- (in symbol CON_HDMI-DP_39_F_1852139, part B) HDMI
- (in symbol MISTRAL_TITLEBLK_CSIZE_1) Title; Project :; Size; Rev; AM69 Edge AI Kit; Date:; Sheet; of